# Altium schematic sheet HallEffectSwitch.SchDoc: HALL Effect Switches
size 431 x 279 mm; Organization: ORGANIZATION; Address1: APPLIED PHYSICS LAB; Address2: UNIVERSITY OF WASHINGTON; Address3: 1013 NE 40TH STREET; Address4: SEATTLE, WA 98105; DocumentNumber: 2; Revision: -; SheetNumber: 2; SheetTotal: 18; ENG_APP_DATE: --/--/--; DSN_APP_DATE: --/--/--; CHK_APP_DATE: --/--/--
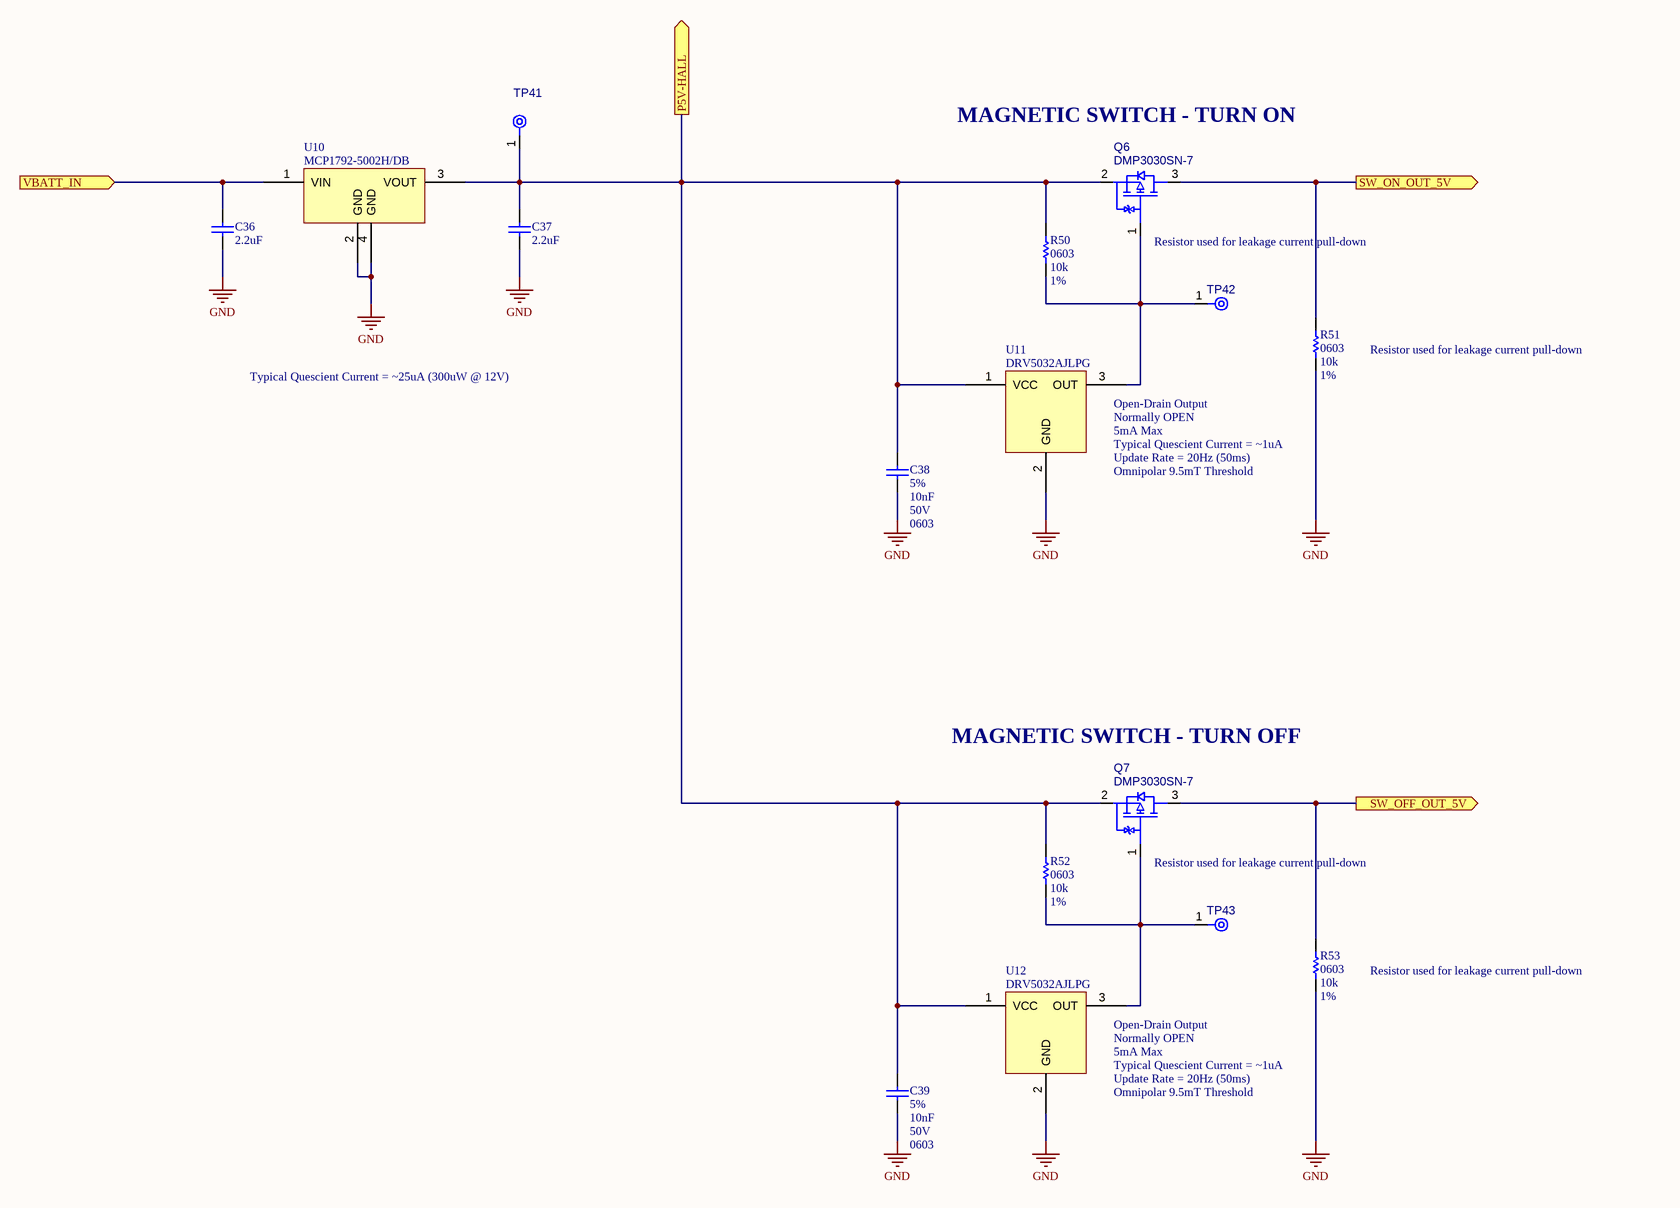
[diagram p0: HallEffectSwitch.SchDoc]

## Parts
C36  value 2.2uF  [CAPC3225X270X30ML30]  (hidden comment: Capacitor 2.2uF 10%, 50V, X7R, 1210)
C37  value 2.2uF  [CAPC3225X270X30ML30]  (hidden comment: Capacitor 2.2uF 10%, 50V, X7R, 1210)
C38  value 10nF  Tolerance: 5%  Voltage Rating: 50V  Case/Package: 0603  [CAPC1608X90X40ML10T20]  (hidden comment: Capacitor 10nF +/- 5%, 50V, C0G, 0603)
C39  value 10nF  Tolerance: 5%  Voltage Rating: 50V  Case/Package: 0603  [CAPC1608X90X40ML10T20]  (hidden comment: Capacitor 10nF +/- 5%, 50V, C0G, 0603)
Q6  DMP3030SN-7  [SOT95P164X140-3M]
Q7  DMP3030SN-7  [SOT95P164X140-3M]
R50  value 10k  Case/Package: 0603  Tolerance: 1%  [RESC1608X55X25ML10T15]  (hidden comment: Resistor 10k +/-1% 0603 100 mW)
R51  value 10k  Case/Package: 0603  Tolerance: 1%  [RESC1608X55X25ML10T15]  (hidden comment: Resistor 10k +/-1% 0603 100 mW)
R52  value 10k  Case/Package: 0603  Tolerance: 1%  [RESC1608X55X25ML10T15]  (hidden comment: Resistor 10k +/-1% 0603 100 mW)
R53  value 10k  Case/Package: 0603  Tolerance: 1%  [RESC1608X55X25ML10T15]  (hidden comment: Resistor 10k +/-1% 0603 100 mW)
TP41  TPAD6R-CIRCLED  [TP06R - Circled]  (value not drawn)  (no BOM)
TP42  TPAD6R-CIRCLED  [TP06R - Circled]  (value not drawn)  (no BOM)
TP43  TPAD6R-CIRCLED  [TP06R - Circled]  (value not drawn)  (no BOM)
U10  MCP1792-5002H/DB  [SOT230P700X180-4M]
U11  DRV5032AJLPG  [DRV5032ZELPGM - 500-92-US Lead Formed]
U12  DRV5032AJLPG  [DRV5032ZELPGM - 500-92-US Lead Formed]

## Ports
P5V-HALL (out), SW_OFF_OUT_5V (out), SW_ON_OUT_5V (out), VBATT_IN (in)

## Nets
GND: C36.1 C37.1 C38.1 C39.1 R51.1 R53.1 U10.2(GND) U10.4(GND) U11.2(GND) U12.2(GND)
P5V-HALL: C37.2 C38.2 C39.2 Q6.2(S) Q7.2(S) R50.2 R52.2 TP41.1(TP) U10.3(VOUT) U11.1(VCC) U12.1(VCC) ; port P5V-HALL
SW_OFF_OUT_5V: Q7.3(D) R53.2 ; port SW_OFF_OUT_5V
SW_ON_OUT_5V: Q6.3(D) R51.2 ; port SW_ON_OUT_5V
VBATT_IN: C36.2 U10.1(VIN) ; port VBATT_IN
NetQ6_1: Q6.1(G) R50.1 TP42.1(TP) U11.3(OUT)
NetQ7_1: Q7.1(G) R52.1 TP43.1(TP) U12.3(OUT)

## Notes on the sheet
- MAGNETIC SWITCH - TURN ON
- (near Q6) Resistor used for leakage current pull-down
- Resistor used for leakage current pull-down
- Typical Quescient Current = ~25uA (300uW @ 12V)
- (near U11) Open-Drain Output
- (near U11) Normally OPEN
- (near U11) 5mA Max
- (near U11) Typical Quescient Current = ~1uA
- (near U11) Update Rate = 20Hz (50ms)
- (near U11) Omnipolar 9.5mT Threshold
- MAGNETIC SWITCH - TURN OFF
- (near Q7) Resistor used for leakage current pull-down
- (near U12) Open-Drain Output
- (near U12) Normally OPEN
- (near U12) 5mA Max
- (near U12) Typical Quescient Current = ~1uA
- (near U12) Update Rate = 20Hz (50ms)
- (near U12) Omnipolar 9.5mT Threshold
- THIS DOCUMENT AND THE DATA DISCLOSED HEREIN OR HEREWITH IS THE PROPERTY OF APPLIED PHYSICS LAB - UNIVERSITY OF WASHINGTON.
- PROJECT
- TITLE
- FILE NAME
- SIZE
- B
- CAGE CODE
- DWG NO.
- SHEET
- OF
- REV

## Library data of the parts
C36 C37 = CMP-001-00182-9: Chip Capacitor, 2.2uF, 10%, 50 V, X7R 1210 (3225 Metric); Decade: 1uF; Capacitor Type: Ceramic; Voltage Rating: 50V; Capacitance: 2.2uF; Max Operating Temperature: 125°C; Pins: 2; Tolerance: 10%; Case/Package: 1210; Min Operating Temperature: -55°C; RoHS Compliant: True; Dielectric: X7R; Mount: Surface Mount
C38 C39 = CMP-001-00166-10: Chip Capacitor, 10nF, +/- 5%, 50 V, C0G 0603 (1608 Metric); Dielectric: C0G, NPO; Capacitor Type: Ceramic; Max Operating Temperature: 125°C; Decade: 10nF; Min Operating Temperature: -55°C; Pins: 2; RoHS Compliant: True; Capacitance: 10nF; Mount: Surface Mount
Q6 Q7 = CMP-013-00050-4: Trans Mosfet P-ch 30V 0.7A 3-PIN SC-59 T/r / Mosfet P-ch 30V 700MA SC59-3; Drain to Source Breakdown Voltage: -30V; Polarity: P-CHANNEL; Max Power Dissipation: 500mW; Rds On Max: 250mR; Transistor Type: PMOS; Min Operating Temperature: -65°C; Power Dissipation: 500mW; Case/Package: SOT-23-3; Max Operating Temperature: 150°C; Mount: Surface Mount
R50-R53 = CMP-009-00017-8: Chip Resistor, 10 KOhm, +/- 1%, 01 W, -55 to 155 degC, 0603 (1608 Metric); Power: 100mW; Voltage Rating: 50V; RoHS Compliant: True; Max Operating Temperature: 155°C; Min Operating Temperature: -55°C; Pins: 2; Decade: 10k; Mount: Surface Mount
TP41-TP43 = CMP-00028-00014-3: 0.6mm round with a silkscreen circle.; Pins: 1
U10 = CMP-019-00076-3: High input voltage regulator 5.0 V 3Ld SOT-223 3 SOT-223 TUBE RoHS Compliant: Yes; Max Input Voltage: 55V; Min Input Voltage: 6.2V; Max Ouput Current: 100mA; Dropout Voltage: 1.2V; Min Operating Temperature: -40C; Max Operating Temperature: 150C; Case/Package: SOT-223-3; Mount: Surface Mount
U11 U12 = CMP-010-00036-4: Low power (5 Hz, <1µA), low voltage (up to 5.5V) switch 3-TO-92 -40 to 85. High sensitivity (9.5mT) Onmipolar operation.; Output Type: Open Drain; Max Output current: 5mA; Min Input Voltage: 1.65V; Sensor Type: Hall Effect Switch; Max Supply Current: 3.5uA; Case/Package: TO-92-3; Max Input Voltage: 5.5V; Magnetic Threshold (Max): 9.5mT; Max Operating Temperature: 85°C; Min Operating Temperature: -40°C; Mount: Through Hole